# EAGLE board Module_control (EAGLE 9.4.2), part 1 of 2
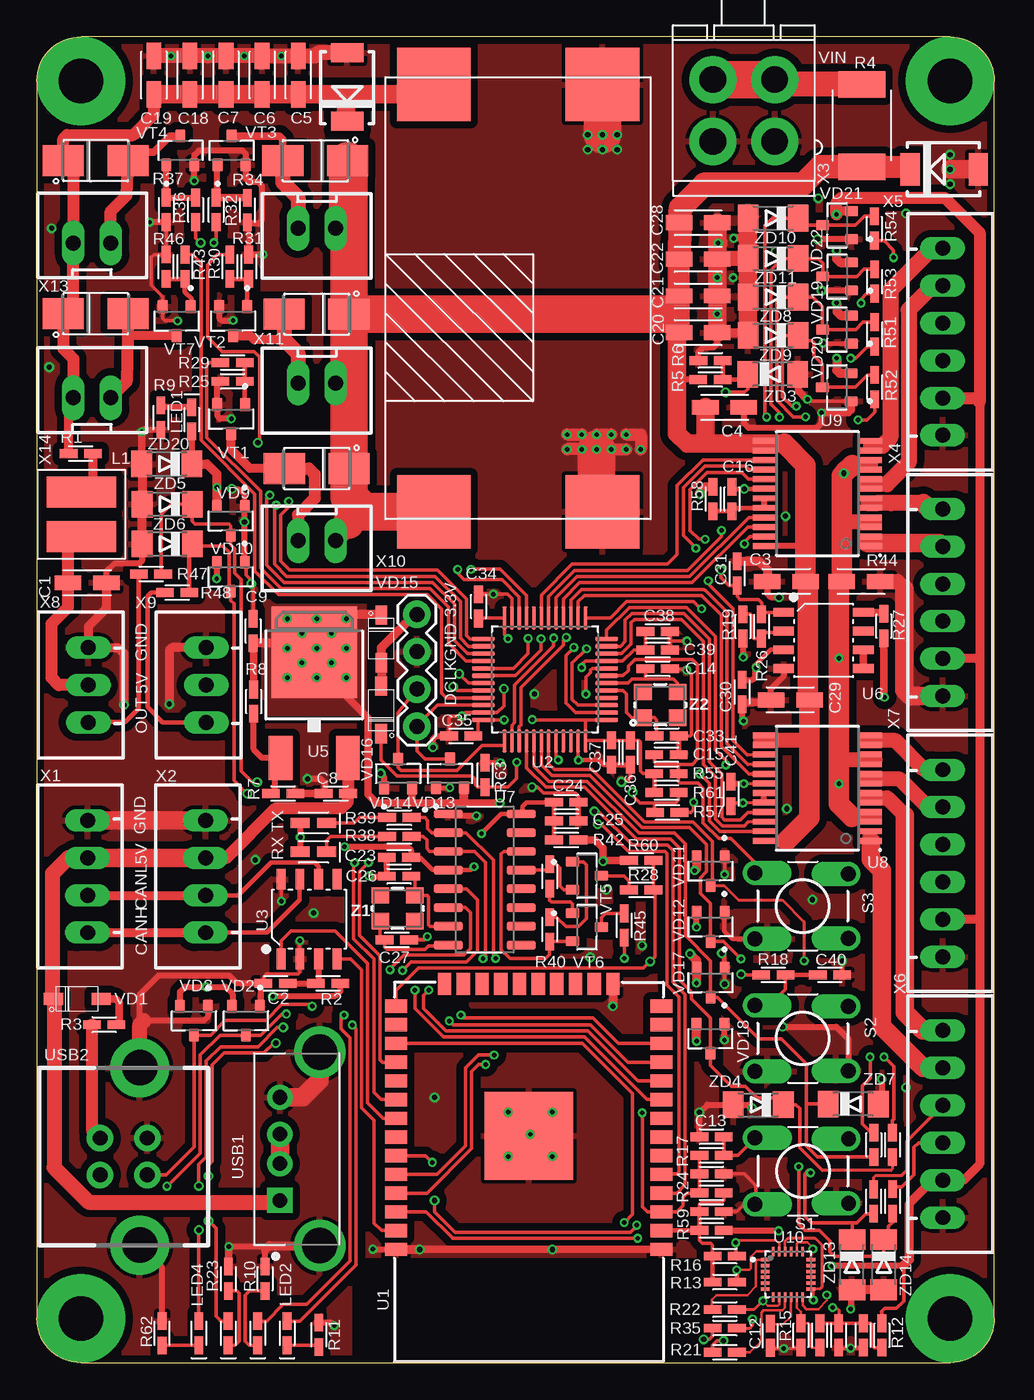
[diagram p4: board, top side]
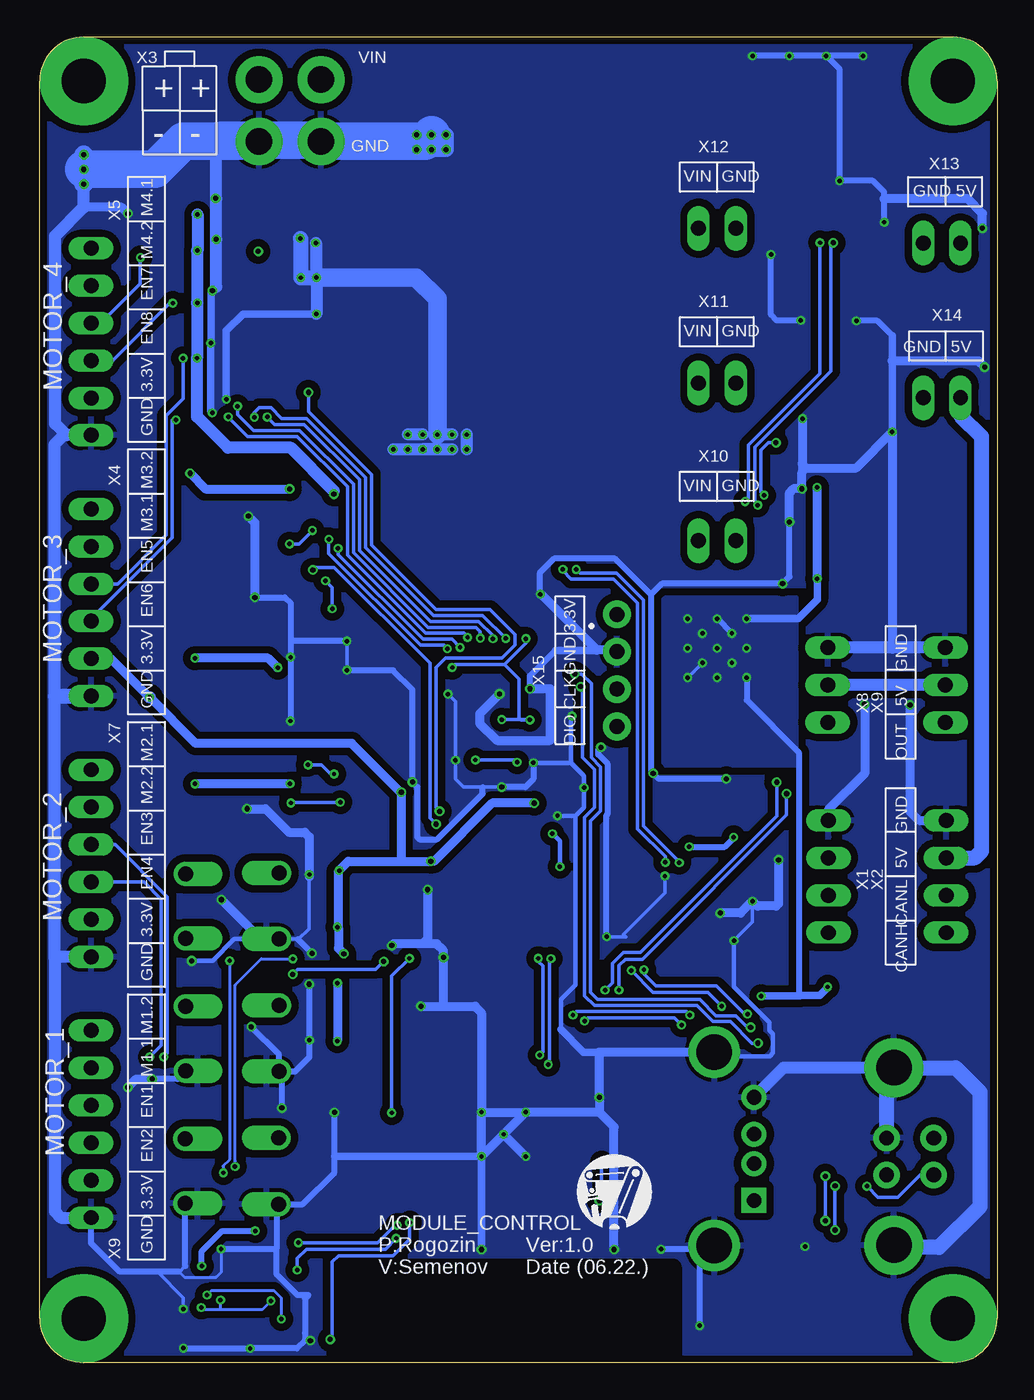
[diagram p5: board, bottom side, seen from below]

Size 65 x 90 mm. Coordinates in mm from the lower left corner, seen from the top.
Outline: 3,0 62,0 arc90 65,3 65,87 arc90 62,90 3,90 arc90 0,87 0,3 arc90 3,0
Copper layers (1*16): Top 0.035mm / dielectric 1.6mm / Bottom 0.035mm
Design rules "rezonit": minimum track width 0.125mm, minimum drill 0.3mm, track to track 0.125mm, track to pad 0.2mm, pad to pad 0.125mm, via to via 0.2mm, smd to smd 0mil, copper to edge 0.4mm, drill to drill 8mil, minimum pad ring 0.2mm, minimum via ring 0.15mm, stop-mask expansion 0.1mm, vias tented up to drill 3mm, thermal gap 10mil

## Footprints (pad centres in the part's own frame; a part is rotated, then mirrored left to right if it is on the bottom)
1206 = smd 1.8 x 1: P$1 -1.3,0; P$2 1.3,0
0603 = smd 1.2 x 0.6: P$1 -0.827,0; P$2 0.827,0
0420CDMC = smd 2.1 x 4.7: 1 -1.5,0; 2 1.5,0
1608 = smd 1.2 x 0.6: P$1 -0.82,0; P$2 0.82,0
2512 = smd 1.8 x 3.2: 1 -2.8,0; 2 2.8,0
2013 = smd 1.3 x 0.7: P$1 -0.9,0.025; P$2 0.9,0.025
DTS-6 = drill 1.016 pad 1.676 offset: 1 -3.25,2.25; 2 3.1,2.185; 3 -3.25,-2.25; 4 3.1,-2.195
ESP-WROOM-32 = smd 1.5 x 0.9: 1 -9,7.7; 2 -9,6.43; 3 -9,5.16; 4 -9,3.89; 5 -9,2.62; 6 -9,1.35; 7 -9,0.08; 8 -9,-1.19; 9 -9,-2.46; 10 -9,-3.73; 11 -9,-5; 12 -9,-6.27; 13 -9,-7.54; 14 -9,-8.81; 25 9,-8.81; 26 9,-7.54; 27 9,-6.27; 28 9,-5; 29 9,-3.73; 30 9,-2.46; 31 9,-1.19; 32 9,0.08; 33 9,1.35; 34 9,2.62; 35 9,3.89; 36 9,5.16; 37 9,6.43; 38 9,7.7 | smd 0.9 x 1.5: 15 -5.715,-10.3; 16 -4.445,-10.3; 17 -3.175,-10.3; 18 -1.905,-10.3; 19 -0.635,-10.3; 20 0.635,-10.3; 21 1.905,-10.3; 22 3.175,-10.3; 23 4.445,-10.3; 24 5.715,-10.3 | smd 6 x 6: GND 0,0
QFP50P900X900X160-48N = smd 1.56 x 0.28: 1 -4.18,2.75; 2 -4.18,2.25; 3 -4.18,1.75; 4 -4.18,1.25; 5 -4.18,0.75; 6 -4.18,0.25; 7 -4.18,-0.25; 8 -4.18,-0.75; 9 -4.18,-1.25; 10 -4.18,-1.75; 11 -4.18,-2.25; 12 -4.18,-2.75; 25 4.18,-2.75; 26 4.18,-2.25; 27 4.18,-1.75; 28 4.18,-1.25; 29 4.18,-0.75; 30 4.18,-0.25; 31 4.18,0.25; 32 4.18,0.75; 33 4.18,1.25; 34 4.18,1.75; 35 4.18,2.25; 36 4.18,2.75 | smd 0.28 x 1.56: 13 -2.75,-4.18; 14 -2.25,-4.18; 15 -1.75,-4.18; 16 -1.25,-4.18; 17 -0.75,-4.18; 18 -0.25,-4.18; 19 0.25,-4.18; 20 0.75,-4.18; 21 1.25,-4.18; 22 1.75,-4.18; 23 2.25,-4.18; 24 2.75,-4.18; 37 2.75,4.18; 38 2.25,4.18; 39 1.75,4.18; 40 1.25,4.18; 41 0.75,4.18; 42 0.25,4.18; 43 -0.25,4.18; 44 -0.75,4.18; 45 -1.25,4.18; 46 -1.75,4.18; 47 -2.25,4.18; 48 -2.75,4.18
SOIC-8 = smd 1.4 x 0.6: 1 -2.7,1.905; 2 -2.7,0.635; 3 -2.7,-0.635; 4 -2.7,-1.905; 5 2.7,-1.905; 6 2.7,-0.635; 7 2.7,0.635; 8 2.7,1.905
MINI560_OTB = smd 5 x 5: +I -14.44,6.76; +O 14.56,6.76; -I -14.44,-4.7; -O 14.56,-4.7
D-PAK = smd 3 x 1.6: 1 -2.26,2.28; 3 -2.26,-2.28 | smd 6.2 x 5.8: 4 4.92,0
SOIC-16 = smd 1.97 x 0.6: 1 -2.475,4.445; 2 -2.475,3.175; 3 -2.475,1.905; 4 -2.475,0.635; 5 -2.475,-0.635; 6 -2.475,-1.905; 7 -2.475,-3.175; 8 -2.475,-4.445; 9 2.475,-4.445; 10 2.475,-3.175; 11 2.475,-1.905; 12 2.475,-0.635; 13 2.475,0.635; 14 2.475,1.905; 15 2.475,3.175; 16 2.475,4.445
SOP65 = smd 1.5 x 0.4: 1 -3.625,3.575; 2 -3.625,2.925; 3 -3.625,2.275; 4 -3.625,1.625; 5 -3.625,0.975; 6 -3.625,0.325; 7 -3.625,-0.325; 8 -3.625,-0.975; 9 -3.625,-1.625; 10 -3.625,-2.275; 11 -3.625,-2.925; 12 -3.625,-3.575; 13 3.625,-3.575; 14 3.625,-2.925; 15 3.625,-2.275; 16 3.625,-1.625; 17 3.625,-0.975; 18 3.625,-0.325; 19 3.625,0.325; 20 3.625,0.975; 21 3.625,1.625; 22 3.625,2.275; 23 3.625,2.925; 24 3.625,3.575
QFN40P300X300X105-24N = smd 0.64 x 0.22: 1 -1.545,1; 2 -1.545,0.6; 3 -1.545,0.2; 4 -1.545,-0.2; 5 -1.545,-0.6; 6 -1.545,-1; 13 1.545,-1; 14 1.545,-0.6; 15 1.545,-0.2; 16 1.545,0.2; 17 1.545,0.6; 18 1.545,1 | smd 0.22 x 0.64: 7 -1,-1.545; 8 -0.6,-1.545; 9 -0.2,-1.545; 10 0.2,-1.545; 11 0.6,-1.545; 12 1,-1.545; 19 1,1.545; 20 0.6,1.545; 21 0.2,1.545; 22 -0.2,1.545; 23 -0.6,1.545; 24 -1,1.545
A-VERTICAL = drill 1 pad 1.7 square: 1 0,0 | drill 1 pad 1.7: 2 2.5,0; 3 4.5,0; 4 7,0 | drill 2.4 pad 3.5: SH1 -3.07,-2.7; SH2 10.07,-2.7
B-VERTICAL = drill 1 pad 1.8: P$1.5V 1.25,1.6; P$2.D- -1.25,1.6; P$3.D+ -1.25,-1.6; P$4.GND 1.25,-1.6 | drill 2.4 pad 4: P$5.SH2 6.02,-1.095; P$6.SH1 -6.02,-1.095
SOD123 = smd 1.3 x 0.8: A -1.68,0; C 1.56,0
SOT23 = smd 0.7 x 0.9: 1 -0.95,-0.98; 2 0.95,-0.98; 3 0,0.98
SMA = smd 2.8 x 2.1: A -2.2,0; C 2.2,0
SOT-23 = smd 0.7 x 0.9: 1 -0.95,-0.98; 2 0.95,-0.98; 3 0,0.98
JST-XH-04 = drill 1.016 long: 1 -3.81,0; 2 -1.27,0; 3 1.27,0; 4 3.81,0
MOLEX-2X2U = drill 1.8 pad 3.2: 1 -2.1,-2.1; 2 2.1,-2.1; 3 -2.1,2.1; 4 2.1,2.1
JST-XH-06 = drill 1.016 long: 1 -6.35,0; 2 -3.81,0; 3 -1.27,0; 4 1.27,0; 5 3.81,0; 6 6.35,0
JST-XH-03 = drill 1.016 long: 1 -2.54,0; 2 0,0; 3 2.54,0
JST-XH-02 = drill 1.016 long: 1 -1.27,0; 2 1.27,0
1X04DUPON = drill 1.016 pad 1.88: 1 0,0; 2 2.54,0; 3 5.08,0; 4 7.62,0
CRYSTAL-SMD-3.2X2.5MM = smd 1.2 x 1.1: 1 -1.159,-0.843; 2 1.191,-0.843; 3 1.191,0.907; 4 -1.159,0.907
SMB = smd 1.3 x 2.2: A 2.32,0; C -2.32,0
MINIMELF = smd 1.4 x 1.8: A 1.7,0; C -1.7,0

## Placement (x,y rotation side)
C1  22uF  [1206]  3.42,52.94 180 top
C2  0.1uF  [0603]  16.21,25.75 0 top
C3  22uF  [1206]  50.89,53.03 0 top
C4  22uF  [1206]  46.69,64.85 180 top
C5  22uF  [1206]  17.75,87.4 270 top
C6  22uF  [1206]  15.3,87.4 270 top
C7  22uF  [1206]  12.85,87.4 270 top
C8  0.1uF  [0603]  20.3,38.63 0 top
C9  0.1uF  [0603]  14.69,49.67 270 top
C10  0.1uF  [0603]  56.1,1.85 90 top
C11  1uF  [0603]  54.43,1.85 90 top
C12  0.1uF  [0603]  49.79,1.84 90 top
C13  0.1uF  [0603]  45.81,15.34 0 top
C14  8.2pF  [0603]  42.15,47.1 180 top
C15  0.1uF  [0603]  42.75,41.27 0 top
C16  0.1uF  [0603]  47.19,58.62 270 top
C17  0.1uF  [0603]  45.81,12.81 180 top
C18  22uF  [1206]  10.4,87.4 270 top
C19  22uF  [1206]  7.95,87.4 270 top
C20  22uF  [1206]  44.9,69.92 180 top
C21  22uF  [1206]  44.9,72.41 180 top
C22  22uF  [1206]  44.9,74.9 180 top
C23  0.1uF  [0603]  24.58,34.29 0 top
C24  0.1uF  [0603]  35.94,38.04 180 top
C25  10uF  [0603]  35.94,36.77 180 top
C26  22pF  [0603]  24.59,33.02 0 top
C27  22pF  [0603]  24.44,28.7 180 top
C28  22uF  [1206]  44.9,77.38 180 top
C29  22uF  [1206]  51.15,44.99 0 top
C30  0.1uF  [0603]  47.88,45.53 90 top
C31  0.1uF  [0603]  47.55,53.58 270 top
C32  0.1uF  [0603]  45.81,10.26 180 top
C33  8.2pF  [0603]  42.76,42.55 180 top
C34  0.1uF  [0603]  29.98,51.34 270 top
C35  0.1uF  [0603]  28.81,42.54 0 top
C36  0.1uF  [0603]  40.29,41.41 90 top
C37  4.7uF  [0603]  39.02,41.42 90 top
C38  10nF  [0603]  42.15,49.64 180 top
C39  1uF  [0603]  42.15,48.37 180 top
C40  0.1uF  [0603]  53.85,26.32 180 top
C41  0.1uF  [0603]  47.13,38.6 270 top
L1  22uH  [0420CDMC]  3.03,57.59 90 top
LED1  GREEN  [1608]  10.52,64.03 270 top
LED2  GREEN  [1608]  17,2 90 top
LED3  RED  [1608]  15,2 90 top
LED4  RED  [1608]  11,2 90 top
LED5  GREEN  [1608]  13,2 90 top
R1  0  [0603]  2.99,61.71 0 top
R2  0  [0603]  19.78,25.75 180 top
R3  0  [0603]  4.58,22.95 180 top
R4  0  [2512]  56,83.98 270 top
R5  10K  [0603]  45.73,66.74 180 top
R6  6.2K  [0603]  45.74,68.03 0 top
R7  1K  [0603]  16.72,38.63 0 top
R8  620  [0603]  14.72,44.87 90 top
R9  1K  [0603]  8.43,64.15 90 top
R10  1K  [0603]  15.5,5.7 270 top
R11  1K  [0603]  19.15,1.9 270 top
R12  0  [0603]  57.37,1.85 90 top
R13  4.7K  [0603]  46.7,5.47 180 top
R14  10K*  [0603]  53.15,1.85 270 top
R15  10K*  [0603]  51.87,1.85 270 top
R16  4.7K  [0603]  46.7,7.24 180 top
R17  470  [0603]  45.81,14.07 180 top
R18  470  [0603]  50,26.33 0 top
R19  1K*  [0603]  47.94,49.98 90 top
R21  10K  [0603]  46.7,0.7 180 top
R22  0*  [0603]  46.7,3.61 0 top
R23  1k  [0603]  13.01,5.7 90 top
R24  10K  [0603]  45.81,11.53 180 top
R25  10K  [0603]  13.29,66.61 180 top
R26  50*  [0603]  49.2,49.98 90 top
R27  0  [0603]  57.5,50 270 top
R28  1K  [0603]  41.03,32.09 0 top
R29  1K  [0603]  13.29,67.88 0 top
R30  1K  [0603]  13.11,74.39 90 top
R31  10K  [0603]  14.39,74.39 270 top
R32  1K  [0603]  12.17,78.25 270 top
R34  10K  [0603]  14.29,78.23 90 top
R35  0*  [0603]  46.7,2.35 0 top
R36  1K  [0603]  10.78,78.25 270 top
R37  10K  [0603]  8.79,78.25 90 top
R38  1K  [0603]  24.61,35.72 180 top
R39  1K  [0603]  24.61,37 180 top
R40  1K  [0603]  34.82,29.41 90 top
R41  1K  [0603]  34.82,33 270 top
R42  0  [0603]  35.94,35.49 180 top
R43  1K  [0603]  10.06,74.39 90 top
R44  0.01  [1206]  55.95,53.03 180 top
R45  1K  [0603]  39.88,29.67 90 top
R46  10K  [0603]  8.77,74.4 270 top
R47  470  [0603]  7.75,53.54 0 top
R48  470  [0603]  9.53,52.28 0 top
R49  470  [0603]  56.83,14.79 90 top
R50  470  [0603]  58.09,14.79 90 top
R51  470  [0603]  56.87,69.8 270 top
R52  470  [0603]  56.88,66.22 270 top
R53  470  [0603]  56.87,73.39 270 top
R54  470  [0603]  56.86,76.99 270 top
R55  10K  [0603]  42.74,39.98 180 top
R57  0  [0603]  42.8,37.35 180 top
R58  0  [0603]  45.91,58.62 90 top
R59  0  [0603]  45.81,8.99 180 top
R60  10K  [0603]  41.03,34.09 0 top
R61  0  [0603]  42.74,38.71 180 top
R62  1k  [0603]  8.5,2 90 top
R63  10K  [0603]  30.42,39.9 270 top
R70  470  [0603]  58.1,10.95 90 top
R71  470  [0603]  56.81,10.94 90 top
RX  green  [2013]  18.78,34.7 180 top
S1  DTS-6DTS-6  [DTS-6]  52.01,13 0 top
S2  DTS-6DTS-6  [DTS-6]  52,22.01 0 top
S3  DTS-6DTS-6  [DTS-6]  52,31 0 top
TX  yellow  [2013]  18.78,36.66 180 top
U1  ESP-WROOM-32  [ESP-WROOM-32]  33.4,15.4 180 top
U2  STM32F103C8T6  [QFP50P900X900X160-48N]  34.5,46.38 180 top
U3  SN65HVD233DRU  [SOIC-8]  18.49,30.11 90 top
U4  MINI_560  [MINI560_OTB]  33.7,72.2 90 top
U5  LM317  [D-PAK]  18.83,43.31 90 top
U6  LM358  [SOIC-8]  53.41,49.03 0 top
U7  CH340  [SOIC-16]  30.4,32.8 0 top
U8  TB6612FNG,C,8,EL  [SOP65]  53,39 180 top
U9  TB6612FNG,C,8,EL  [SOP65]  53,59 180 top
U10  MPU-9250  [QFN40P300X300X105-24N]  51,6 0 top
USB1  USB-A  [A-VERTICAL]  16.5,11.01 90 top
USB2  USB_AB  [B-VERTICAL]  5.9,14 90 top
VD1  1N5918  [SOD123]  2.69,24.7 180 top
VD2  NUP1301  [SOT23]  14.2,23.21 180 top
VD3  NUP1301  [SOT23]  10.67,23.21 180 top
VD4  M7  [SMA]  4,71.2 180 top
VD5  M7  [SMA]  4,81.6 180 top
VD6  M7  [SMA]  19,60.7 0 top
VD7  M7  [SMA]  18.99,71.18 0 top
VD8  M7  [SMA]  18.9,81.6 0 top
VD9  NUP1301  [SOT23]  13.17,57.14 180 top
VD10  NUP1301  [SOT23]  13.17,53.35 180 top
VD11  NUP1301  [SOT23]  45.74,33.37 180 top
VD12  NUP1301  [SOT23]  45.74,29.58 180 top
VD13  NUP1301  [SOT23]  28.05,40 0 top
VD14  NUP1301  [SOT23]  24.53,39.99 0 top
VD15  5819  [SOD123]  23.39,49.19 90 top
VD16  5819  [SOD123]  23.37,44.25 270 top
VD17  NUP1301  [SOT23]  45.74,25.79 180 top
VD18  NUP1301  [SOT23]  45.73,22 180 top
VD19  NUP1301  [SOT23]  54.32,70.13 90 top
VD20  NUP1301  [SOT23]  54.31,66.21 90 top
VD21  NUP1301  [SOT23]  54.33,77.21 90 top
VD22  NUP1301  [SOT23]  54.33,73.73 90 top
VT1  BCV27  [SOT-23]  13.2,64.05 180 top
VT2  BCV27  [SOT-23]  13.33,70.7 180 top
VT3  BCV27  [SOT-23]  13.22,82.29 0 top
VT4  BCV27  [SOT-23]  9.75,82.29 0 top
VT5  MMBT2222  [SOT-23]  37.35,33.05 270 top
VT6  MMBT2222  [SOT-23]  37.35,29.56 270 top
VT7  BCV27  [SOT-23]  9.5,70.7 180 top
X1  JST_XH_4  [JST-XH-04]  3.45,33 90 top
X2  JST_XH_4  [JST-XH-04]  11.45,33 90 top
X3  MOLEX4X4  [MOLEX-2X2U]  48,85 0 top
X4  JST_HX_6  [JST-XH-06]  61.5,51.6 270 top
X5  JST_XH_6  [JST-XH-06]  61.5,69.3 270 top
X6  JST_HX_6  [JST-XH-06]  61.5,16.2 270 top
X7  JST_XH_6  [JST-XH-06]  61.5,33.9 270 top
X8  1X3JST-XH-03  [JST-XH-03]  3.5,46 90 top
X9  1X3JST-XH-03  [JST-XH-03]  11.5,46 90 top
X10  JST_XH_2  [JST-XH-02]  19,55.8 180 top
X11  JST_HX_2  [JST-XH-02]  19,66.5 180 top
X12  JST_XH_2  [JST-XH-02]  19,77 180 top
X13  JST_HX_2  [JST-XH-02]  3.75,76 0 top
X14  JST_XH_2  [JST-XH-02]  3.75,65.5 0 top
X15  DUPON4  [1X04DUPON]  25.8,50.8 270 top
Z1  12MHz  [CRYSTAL-SMD-3.2X2.5MM]  24.51,30.87 180 top
Z2  8MHz  [CRYSTAL-SMD-3.2X2.5MM]  42.34,44.69 180 top
ZD1  1SMA5925  [SMB]  61.6,81 0 top
ZD2  SMB-J5  [SMB]  21.07,86.6 90 top
ZD3  3.3V  [MINIMELF]  49.96,67.1 0 top
ZD4  3.3V  [MINIMELF]  48.98,17.51 180 top
ZD5  3.3V  [MINIMELF]  8.85,58.28 180 top
ZD6  3.3V  [MINIMELF]  8.85,55.58 180 top
ZD7  3.3V  [MINIMELF]  55.43,17.56 0 top
ZD8  3.3V  [MINIMELF]  49.99,72.33 180 top
ZD9  3.3V  [MINIMELF]  49.98,69.73 180 top
ZD10  3.3V  [MINIMELF]  49.98,77.69 180 top
ZD11  3.3V  [MINIMELF]  49.99,74.95 180 top
ZD13  3.3V  [MINIMELF]  55.34,6.65 270 top
ZD14  3.3V  [MINIMELF]  57.5,6.65 270 top
ZD20  3V3  [MINIMELF]  8.82,61.01 180 top